# Altium schematic sheet stm32.SchDoc
size A4; SheetNumber: 1; SheetTotal: 1
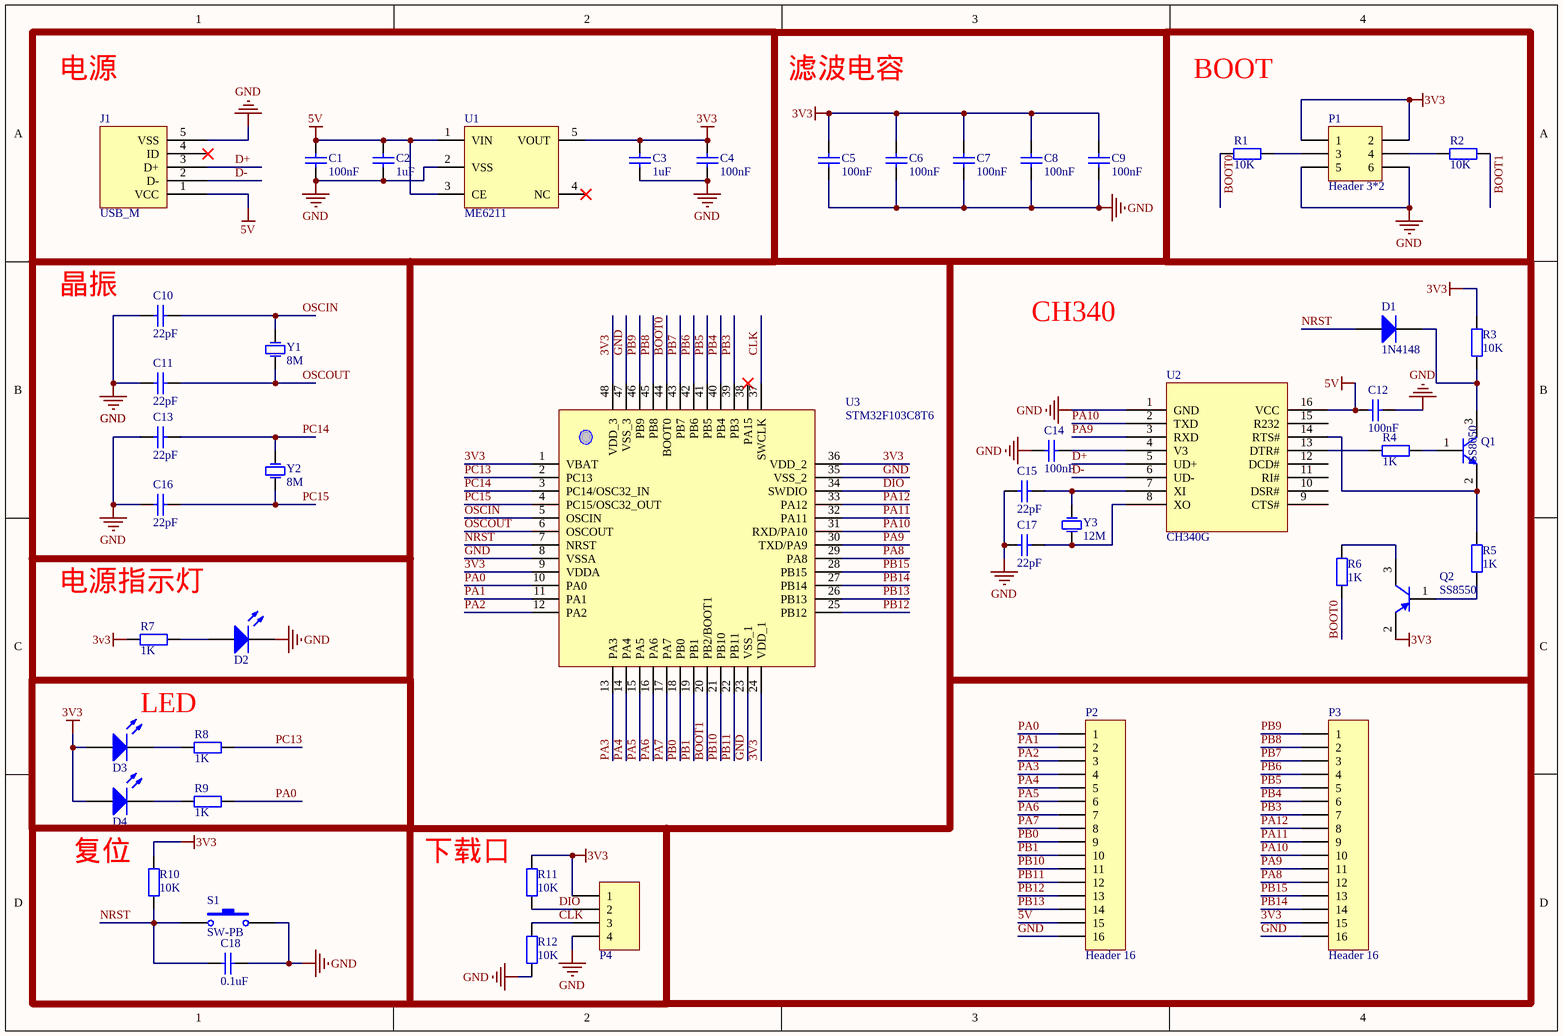
[diagram p0: stm32.SchDoc]

## Parts
C1  value 100nF  [0603_C]  (hidden comment: Cap)
C2  value 1uF  [0603_C]  (hidden comment: Cap)
C3  value 1uF  [0603_C]  (hidden comment: Cap)
C4  value 100nF  [0603_C]  (hidden comment: Cap)
C5  value 100nF  [0603_C]  (hidden comment: Cap)
C6  value 100nF  [0603_C]  (hidden comment: Cap)
C7  value 100nF  [0603_C]  (hidden comment: Cap)
C8  value 100nF  [0603_C]  (hidden comment: Cap)
C9  value 100nF  [0603_C]  (hidden comment: Cap)
C10  value 22pF  [0603_C]  (hidden comment: Cap)
C11  value 22pF  [0603_C]  (hidden comment: Cap)
C12  value 100nF  [0603_C]  (hidden comment: Cap)
C13  value 22pF  [0603_C]  (hidden comment: Cap)
C14  value 100nF  [0603_C]  (hidden comment: Cap)
C15  value 22pF  [0603_C]  (hidden comment: Cap)
C16  value 22pF  [0603_C]  (hidden comment: Cap)
C17  value 22pF  [0603_C]  (hidden comment: Cap)
C18  value 0.1uF  [0603_C]  (hidden comment: Cap)
D1  Type: 1N4148  [SOD-323]  (hidden comment: Diode)
D2  LED0  [LED_0805_Blue]  (value not drawn)
D3  LED0  [LED_0805_Blue]  (value not drawn)
D4  LED0  [LED_0805_Blue]  (value not drawn)
J1  USB_M  [USB]
P1  Header 3*2  [HDR3X2]
P2  Header 16  [HDR16X1_A]
P3  Header 16  [HDR16X1_A]
P4  Header 4  [HDR4X1_A]  (value not drawn)
Q1  SS8050  [SOT-23]
Q2  SS8550  [SOT-23]
R1  value 10K  [0603_R]  (hidden comment: Res1)
R2  value 10K  [0603_R]  (hidden comment: Res1)
R3  value 10K  [0603_R]  (hidden comment: Res1)
R4  value 1K  [0603_R]  (hidden comment: Res1)
R5  value 1K  [0603_R]  (hidden comment: Res1)
R6  value 1K  [0603_R]  (hidden comment: Res1)
R7  value 1K  [0603_R]  (hidden comment: Res1)
R8  value 1K  [0603_R]  (hidden comment: Res1)
R9  value 1K  [0603_R]  (hidden comment: Res1)
R10  value 10K  [0603_R]  (hidden comment: Res1)
R11  value 10K  [0603_R]  (hidden comment: Res1)
R12  value 10K  [0603_R]  (hidden comment: Res1)
S1  SW-PB  [SW_PB2_A1]
U1  ME6211  [SOT23-5]
U2  CH340G  [SOP-16]
U3  STM32F103C8T6  [LQFP-48_M]
Y1  8M  [5032]
Y2  8M  [3215]
Y3  12M  [5032]

## Blocks framed on the sheet
电源: C1-C4 J1 U1

## Nets
3V3: C3.2 C4.2 C5.2 C6.2 C7.2 C8.2 C9.2 D3.1(A) D4.1(A) P1.1 P1.2 P3.15 P4.1 Q2.2(E) R3.2 R7.1 R10.2 R11.2 U1.5(VOUT) U3.1(VBAT) U3.9(VDDA) U3.24(VDD_1) U3.36(VDD_2) U3.48(VDD_3)
5V: C1.2 C2.2 C12.1 J1.1(VCC) P2.15 U1.1(VIN) U1.3(CE) U2.16(VCC)
GND: C1.1 C2.1 C3.1 C4.1 C5.1 C6.1 C7.1 C8.1 C9.1 C10.1 C11.1 C12.2 C13.1 C14.1 C15.1 C16.1 C17.1 C18.2 D2.2(K) J1.5(VSS) P1.5 P1.6 P2.16 P3.16 P4.4 R12.1 S1.2 U1.2(VSS) U2.1(GND) U3.8(VSSA) U3.23(VSS_1) U3.35(VSS_2) U3.47(VSS_3)
BOOT0: R1.1 R6.2 U3.44(BOOT0)
BOOT1: R2.2 U3.20(PB2/BOOT1)
CLK: P4.3 R12.2 U3.37(SWCLK)
D+: J1.3(D+) U2.5(UD+)
D-: J1.2(D-) U2.6(UD-)
DIO: P4.2 R11.1 U3.34(SWDIO)
NRST: C18.1 D1.1(A) R10.1 S1.1 U3.7(NRST)
OSCIN: C10.2 U3.5(OSCIN) Y1.1(OSC1)
OSCOUT: C11.2 U3.6(OSCOUT) Y1.2(OSC2)
PA0: P2.1 R9.2 U3.10(PA0)
PA1: P2.2 U3.11(PA1)
PA2: P2.3 U3.12(PA2)
PA3: P2.4 U3.13(PA3)
PA4: P2.5 U3.14(PA4)
PA5: P2.6 U3.15(PA5)
PA6: P2.7 U3.16(PA6)
PA7: P2.8 U3.17(PA7)
PA8: P3.12 U3.29(PA8)
PA9: P3.11 U2.3(RXD) U3.30(TXD/PA9)
PA10: P3.10 U2.2(TXD) U3.31(RXD/PA10)
PA11: P3.9 U3.32(PA11)
PA12: P3.8 U3.33(PA12)
PB0: P2.9 U3.18(PB0)
PB1: P2.10 U3.19(PB1)
PB3: P3.7 U3.39(PB3)
PB4: P3.6 U3.40(PB4)
PB5: P3.5 U3.41(PB5)
PB6: P3.4 U3.42(PB6)
PB7: P3.3 U3.43(PB7)
PB8: P3.2 U3.45(PB8)
PB9: P3.1 U3.46(PB9)
PB10: P2.11 U3.21(PB10)
PB11: P2.12 U3.22(PB11)
PB12: P2.13 U3.25(PB12)
PB13: P2.14 U3.26(PB13)
PB14: P3.14 U3.27(PB14)
PB15: P3.13 U3.28(PB15)
PC13: R8.2 U3.2(PC13)
PC14: C13.2 U3.3(PC14/OSC32_IN) Y2.1(OSC1)
PC15: C16.2 U3.4(PC15/OSC32_OUT) Y2.2(OSC2)
NetC14_2: C14.2 U2.4(V3)
NetC15_2: C15.2 U2.7(XI) Y3.1(OSC1)
NetC17_2: C17.2 U2.8(XO) Y3.2(OSC2)
NetD1_2: D1.2(K) Q1.3(C) R3.1
NetD2_1: D2.1(A) R7.2
NetD3_2: D3.2(K) R8.1
NetD4_2: D4.2(K) R9.1
NetP1_3: P1.3 R1.2
NetP1_4: P1.4 R2.1
NetQ1_1: Q1.1(B) R4.1
NetQ1_2: Q1.2(E) R5.1 U2.14(RTS#)
NetQ2_1: Q2.1(B) R5.2
NetQ2_3: Q2.3(C) R6.1
NetR4_2: R4.2 U2.13(DTR#)

Not connected (* = marked no-connect by the designer): J1 4(ID)*; U1 4(NC)*; U2 9(CTS#) 10(DSR#) 11(RI#) 12(DCD#) 15(R232); U3 38(PA15)*

## Notes on the sheet
- 滤波电容
- BOOT
- 晶振
- CH340
- 电源指示灯
- LED
- 复位
- 下载口

## Library data of the parts
C1-C18 = Cap: 无极性电容; Published: 8-Jun-2000; LatestRevisionDate: 17-Jul-2002; LatestRevisionNote: Re-released for DXP Platform.; PackageReference: RAD-0.3; Publisher: Altium Limited
D1 = Diode: 二极管; Published: 8-Jun-2000; LatestRevisionDate: 17-Jul-2002; LatestRevisionNote: Re-released for DXP Platform.; PackageDocument: Sep-1996; PackageReference: SMC; Publisher: Altium Limited; Code_JEDEC: DO-214-AB
D2-D4 = LED0: 发光二极管; Published: 8-Jun-2000; LatestRevisionDate: 08-Jul-2005; LatestRevisionNote: Mech Layer 1 removed.; PackageReference: LED-0; Publisher: Altium Limited
J1 = USB_M: MicroUSB接口
P1 = Header 3*2: 接插件
P2 P3 = Header 16: Header16贴片; LatestRevisionDate: 17-Jul-2002; LatestRevisionNote: Re-released for DXP Platform.; Publisher: Altium Limited
P4 = Header 4: 接插件; LatestRevisionDate: 17-Jul-2002; LatestRevisionNote: Re-released for DXP Platform.; Publisher: Altium Limited
Q1 = SS8050: NPN贴片三极管; Published: 8-Jun-2000; LatestRevisionDate: 15-Jan-2003; LatestRevisionNote: PCB Footprint 'BCY-W3/D4.7' replaced; DatasheetDocument: 1997; PackageDocument: Sep-1998; PackageReference: TO-92A; Publisher: Altium Limited; Code_JEDEC: TO-92A; ComponentLink1Description: Manufacturer Link; ComponentLink1URL: http://www.fairchildsemi.com/; ComponentLink2Description: Datasheet; ComponentLink2URL: http://www.fairchildsemi.com/ds/2N%2F2N3904.pdf
Q2 = SS8550: PNP贴片三极管; Published: 8-Jun-2000; LatestRevisionDate: 15-Jan-2003; LatestRevisionNote: PCB Footprint 'BCY-W3/D4.7' replaced; DatasheetDocument: 1997; PackageDocument: Sep-1998; PackageReference: TO-92A; Publisher: Altium Limited; Code_JEDEC: TO-92A; ComponentLink1Description: Manufacturer Link; ComponentLink1URL: http://www.fairchildsemi.com/; ComponentLink2Description: Datasheet; ComponentLink2URL: http://www.fairchildsemi.com/ds/2N%2F2N3906.pdf
R1-R12 = Res1: 贴片电阻; Published: 8-Jun-2000; LatestRevisionDate: 17-Jul-2002; LatestRevisionNote: Re-released for DXP Platform.; PackageReference: AXIAL-0.4; Publisher: Altium Limited
S1 = SW-PB: 微动开关; Published: 24-Mar-1999; LatestRevisionDate: 17-Jul-2002; LatestRevisionNote: Re-released for DXP Platform.; PackageReference: SPST-2; Publisher: Altium Limited
U2 = CH340G: 串口芯片
U3 = STM32F103C8T6: STM32单片机48引脚
Y1-Y3 = XTAL: 晶振; Published: 8-Jun-2000; LatestRevisionDate: 17-Jul-2002; LatestRevisionNote: Re-released for DXP Platform.; PackageReference: R38; Publisher: Altium Limited